# Altium schematic sheet J1962 Connector.SchDoc
size A4; SheetNumber: 3; SheetTotal: 7
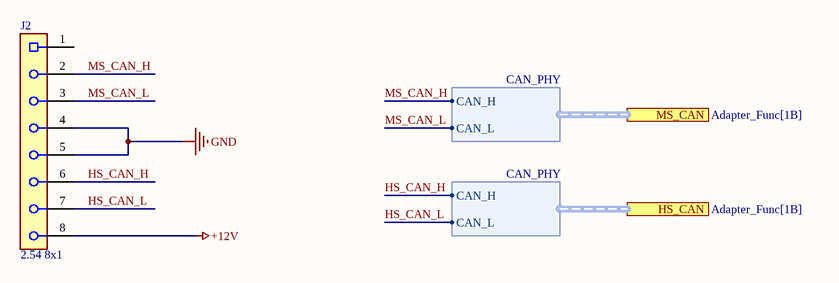
[diagram p0: J1962 Connector.SchDoc]

## Parts
J2  2.54 8x1  [PLS-8X1]

## Ports
HS_CAN (harness CAN_PHY, see Adapter_Func[1B]), MS_CAN (harness CAN_PHY, see Adapter_Func[1B])

## Harnesses
CAN_PHY: CAN_H, CAN_L

## Nets
+12V: J2.8
GND: J2.4 J2.5
HS_CAN_H: J2.6 ; port HS_CAN.CAN_H
HS_CAN_L: J2.7 ; port HS_CAN.CAN_L
MS_CAN_H: J2.2 ; port MS_CAN.CAN_H
MS_CAN_L: J2.3 ; port MS_CAN.CAN_L

Not connected (* = marked no-connect by the designer): J2 1

## Library data of the parts
J2 = 2.54mm 8x1